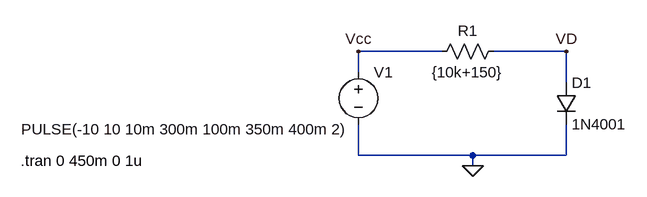
[diagram p0: schematic Diodo.asc]
Diodo.asc, the LTspice schematic file:
Version 4
SHEET 1 880 680
WIRE 0 64 -128 64
WIRE 192 64 80 64
WIRE -128 96 -128 64
WIRE 192 112 192 64
WIRE -128 224 -128 176
WIRE 48 224 -128 224
WIRE 192 224 192 176
WIRE 192 224 48 224
WIRE 48 240 48 224
FLAG 48 240 0
FLAG 192 64 VD
FLAG -128 64 Vcc
SYMBOL diode 176 112 R0
SYMATTR InstName D1
SYMATTR Value 1N4001
SYMBOL res 96 48 R90
WINDOW 0 0 56 VBottom 2
WINDOW 3 32 56 VTop 2
SYMATTR InstName R1
SYMATTR Value {10k+150}
SYMBOL voltage -128 80 R0
WINDOW 3 -519 104 Left 2
WINDOW 123 0 0 Left 0
WINDOW 39 0 0 Left 0
SYMATTR Value PULSE(-10 10 10m 300m 100m 350m 400m 2)
SYMATTR InstName V1
TEXT -648 232 Left 2 !.tran 0 450m 0 1u

The netlist it stands for:
* Diodo.asc
D1 VD 0 1N4001
R1 VD Vcc {10k+150}
V1 Vcc 0 PULSE(-10 10 10m 300m 100m 350m 400m 2)
.model D D
.lib standard.dio
.tran 0 450m 0 1u
.backanno
.end

* Results of the author's LTspice run, read from the files saved beside the schematic
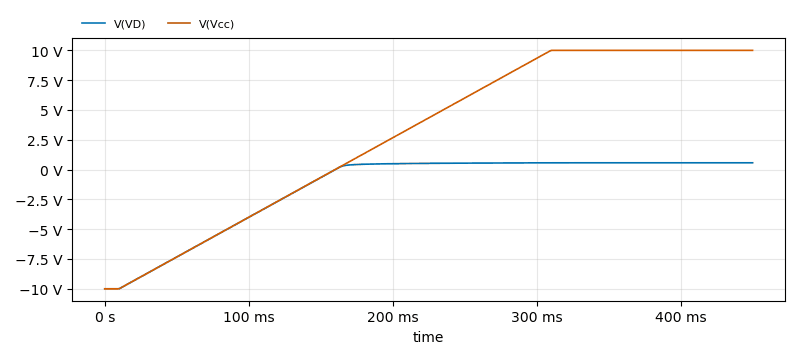
[diagram p1: Transient Analysis of Diodo.asc, plotted from the saved traces]
* Transient Analysis, 1 run:
*   V(VD): min -10 V, max 569.4 mV, average -1.543 V, rms 3.677 V, last 569.4 mV
*   V(Vcc): min -10 V, max 10 V, average 2.889 V, rms 7.454 V, last 10 V